# EAGLE design FrontendA (EAGLE 9.6.2)
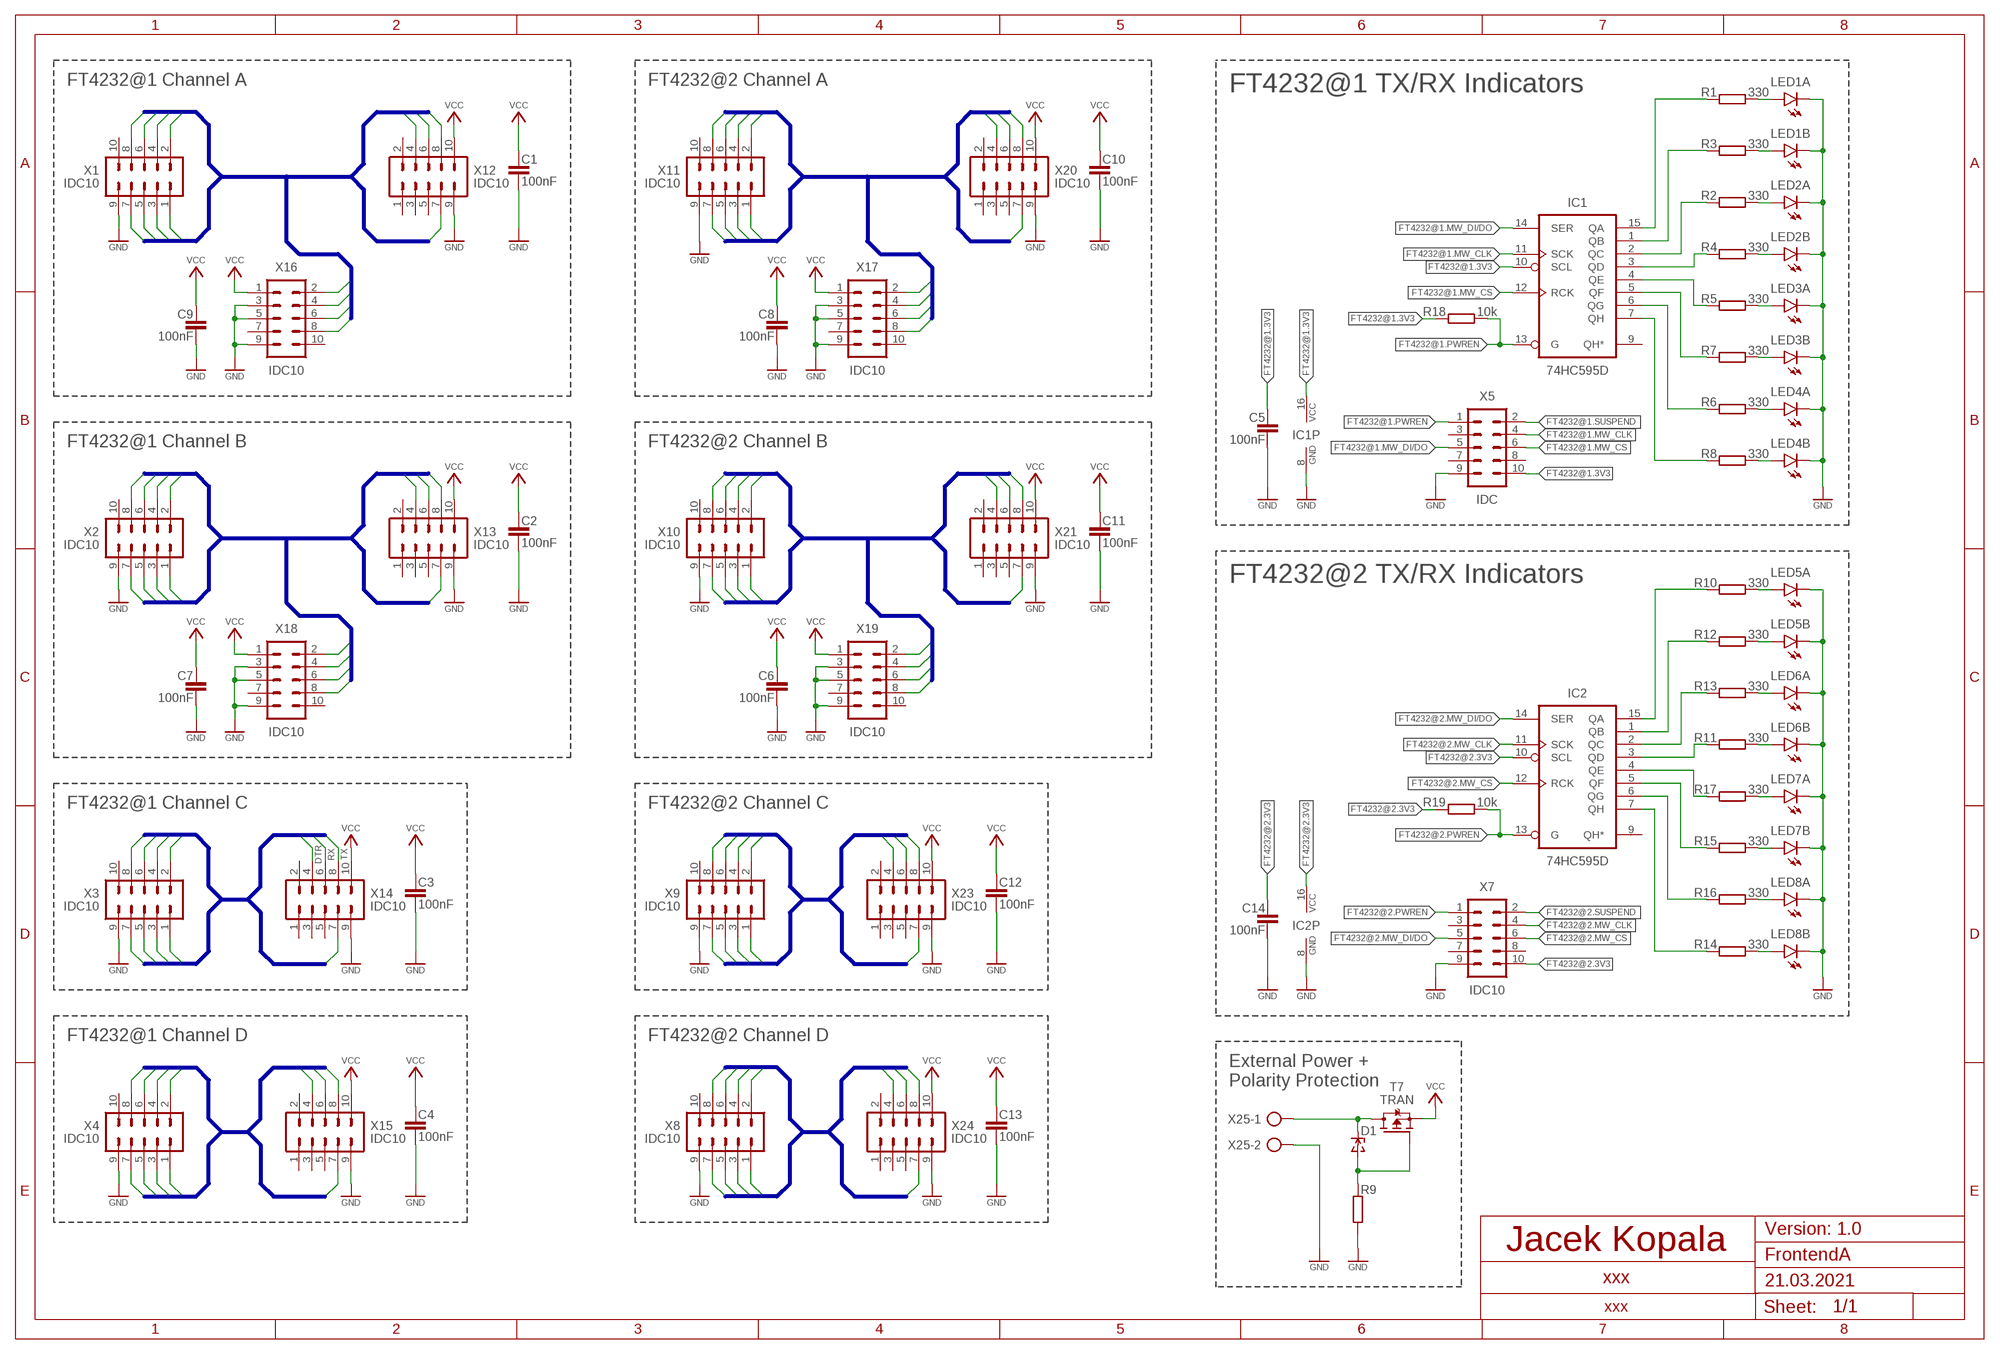
[diagram p0: schematic, sheet 1]

## Parts
C1  100nF  C-EUC0805  [C0805]
C2  100nF  C-EUC0805  [C0805]
C3  100nF  C-EUC0805  [C0805]
C4  100nF  C-EUC0805  [C0805]
C5  100nF  C-EUC0805  [C0805]
C6  100nF  C-EUC0805  [C0805]
C7  100nF  C-EUC0805  [C0805]
C8  100nF  C-EUC0805  [C0805]
C9  100nF  C-EUC0805  [C0805]
C10  100nF  C-EUC0805  [C0805]
C11  100nF  C-EUC0805  [C0805]
C12  100nF  C-EUC0805  [C0805]
C13  100nF  C-EUC0805  [C0805]
C14  100nF  C-EUC0805  [C0805]
D1  ZENERSOD-323F  [SOD-323F]
IC1  74HC595D  [SO16]
IC2  74HC595D  [SO16]
LED1  LSG-T676  [WL-SFCW-0603]
LED2  LSG-T676  [WL-SFCW-0603]
LED3  LSG-T676  [WL-SFCW-0603]
LED4  LSG-T676  [WL-SFCW-0603]
LED5  LSG-T676  [WL-SFCW-0603]
LED6  LSG-T676  [WL-SFCW-0603]
LED7  LSG-T676  [WL-SFCW-0603]
LED8  LSG-T676  [WL-SFCW-0603]
R1  330  R-EU_R0805  [R0805]
R2  330  R-EU_R0805  [R0805]
R3  330  R-EU_R0805  [R0805]
R4  330  R-EU_R0805  [R0805]
R5  330  R-EU_R0805  [R0805]
R6  330  R-EU_R0805  [R0805]
R7  330  R-EU_R0805  [R0805]
R8  330  R-EU_R0805  [R0805]
R9  R-EU_R0805  [R0805]
R10  330  R-EU_R0805  [R0805]
R11  330  R-EU_R0805  [R0805]
R12  330  R-EU_R0805  [R0805]
R13  330  R-EU_R0805  [R0805]
R14  330  R-EU_R0805  [R0805]
R15  330  R-EU_R0805  [R0805]
R16  330  R-EU_R0805  [R0805]
R17  330  R-EU_R0805  [R0805]
R18  10k  R-EU_R0805  [R0805]
R19  10k  R-EU_R0805  [R0805]
T7  TRAN  FDD4141TO252  [TO252]
X1  IDC10  MA05-2  [MA05-2]
X2  IDC10  MA05-2  [MA05-2]
X3  IDC10  MA05-2  [MA05-2]
X4  IDC10  MA05-2  [MA05-2]
X5  IDC  MA05-2  [MA05-2]
X7  IDC10  MA05-2  [MA05-2]
X8  IDC10  MA05-2  [MA05-2]
X9  IDC10  MA05-2  [MA05-2]
X10  IDC10  MA05-2  [MA05-2]
X11  IDC10  MA05-2  [MA05-2]
X12  IDC10  ML10  [ML10]
X13  IDC10  ML10  [ML10]
X14  IDC10  ML10  [ML10]
X15  IDC10  ML10  [ML10]
X16  IDC10  ML10  [ML10]
X17  IDC10  ML10  [ML10]
X18  IDC10  ML10  [ML10]
X19  IDC10  ML10  [ML10]
X20  IDC10  ML10  [ML10]
X21  IDC10  ML10  [ML10]
X23  IDC10  ML10  [ML10]
X24  IDC10  ML10  [ML10]
X25  AK500/2  [AK500/2]

## Nets
FT4232@1.3V3: C5.1 IC1.10(SCL) IC1.16(VCC) R18.2 X5.10
FT4232@1.AD0: X1.1 X12.8 X16.4
FT4232@1.AD1: X1.2 X12.6 X16.8
FT4232@1.AD2: X1.3 X12.7 X16.6
FT4232@1.AD3: X1.4 X16.2
FT4232@1.AD4: X1.5 X12.4
FT4232@1.AD5: X1.6
FT4232@1.AD6: X1.7
FT4232@1.AD7: X1.8
FT4232@1.BD0: X2.1 X13.8 X18.4
FT4232@1.BD1: X2.2 X13.6 X18.8
FT4232@1.BD2: X2.3 X13.7 X18.6
FT4232@1.BD3: X2.4 X18.2
FT4232@1.BD4: X2.5 X13.4
FT4232@1.BD5: X2.6
FT4232@1.BD6: X2.7
FT4232@1.BD7: X2.8
FT4232@1.CD0: X3.1 X14.8
FT4232@1.CD1: X3.2 X14.6
FT4232@1.CD2: X3.3 X14.7
FT4232@1.CD3: X3.4
FT4232@1.CD4: X3.5 X14.4
FT4232@1.CD5: X3.6
FT4232@1.CD6: X3.7
FT4232@1.CD7: X3.8
FT4232@1.DD0: X4.1 X15.8
FT4232@1.DD1: X4.2 X15.6
FT4232@1.DD2: X4.3 X15.7
FT4232@1.DD3: X4.4
FT4232@1.DD4: X4.5 X15.4
FT4232@1.DD5: X4.6
FT4232@1.DD6: X4.7
FT4232@1.DD7: X4.8
FT4232@1.MW_CLK: IC1.11(SCK) X5.4
FT4232@1.MW_CS: IC1.12(RCK) X5.6
FT4232@1.MW_DI/DO: IC1.14(SER) X5.5
FT4232@1.PWREN: IC1.13(G) R18.1 X5.1
FT4232@1.SUSPEND: X5.2
FT4232@2.3V3: C14.1 IC2.10(SCL) IC2.16(VCC) R19.2 X7.10
FT4232@2.AD0: X11.1 X17.4 X20.8
FT4232@2.AD1: X11.2 X17.8 X20.6
FT4232@2.AD2: X11.3 X17.6 X20.7
FT4232@2.AD3: X11.4 X17.2
FT4232@2.AD4: X11.5 X20.4
FT4232@2.AD5: X11.6
FT4232@2.AD6: X11.7
FT4232@2.AD7: X11.8
FT4232@2.BD0: X10.1 X19.4 X21.8
FT4232@2.BD1: X10.2 X19.8 X21.6
FT4232@2.BD2: X10.3 X19.6 X21.7
FT4232@2.BD3: X10.4 X19.2
FT4232@2.BD4: X10.5 X21.4
FT4232@2.BD5: X10.6
FT4232@2.BD6: X10.7
FT4232@2.BD7: X10.8
FT4232@2.CD0: X9.1 X23.8
FT4232@2.CD1: X9.2 X23.6
FT4232@2.CD2: X9.3 X23.7
FT4232@2.CD3: X9.4
FT4232@2.CD4: X9.5 X23.4
FT4232@2.CD5: X9.6
FT4232@2.CD6: X9.7
FT4232@2.CD7: X9.8
FT4232@2.DD0: X8.1 X24.8
FT4232@2.DD1: X8.2 X24.6
FT4232@2.DD2: X8.3 X24.7
FT4232@2.DD3: X8.4
FT4232@2.DD4: X8.5 X24.4
FT4232@2.DD5: X8.6
FT4232@2.DD6: X8.7
FT4232@2.DD7: X8.8
FT4232@2.MW_CLK: IC2.11(SCK) X7.4
FT4232@2.MW_CS: IC2.12(RCK) X7.6
FT4232@2.MW_DI/DO: IC2.14(SER) X7.5
FT4232@2.PWREN: IC2.13(G) R19.1 X7.1
FT4232@2.SUSPEND: X7.2
GND: C1.2 C2.2 C3.2 C4.2 C5.2 C6.2 C7.2 C8.2 C9.2 C10.2 C11.2 C12.2 C13.2 C14.2 IC1.8(GND) IC2.8(GND) LED1.P$1(A:C) LED1.P$3(B:C) LED2.P$1(A:C) LED2.P$3(B:C) LED3.P$1(A:C) LED3.P$3(B:C) LED4.P$1(A:C) LED4.P$3(B:C) LED5.P$1(A:C) LED5.P$3(B:C) LED6.P$1(A:C) LED6.P$3(B:C) LED7.P$1(A:C) LED7.P$3(B:C) LED8.P$1(A:C) LED8.P$3(B:C) R9.1 X1.9 X2.9 X3.9 X4.9 X5.9 X7.9 X8.9 X9.9 X10.9 X11.9 X12.9 X13.9 X14.9 X15.9 X16.3 X16.5 X16.9 X17.3 X17.5 X17.9 X18.3 X18.5 X18.9 X19.3 X19.5 X19.9 X20.9 X21.9 X23.9 X24.9 X25.2
N$5: LED1.P$2(A:A) R1.2
N$6: LED1.P$4(B:A) R3.2
N$7: LED5.P$2(A:A) R10.2
N$8: LED5.P$4(B:A) R12.2
N$9: LED2.P$2(A:A) R2.2
N$10: LED2.P$4(B:A) R4.2
N$11: LED3.P$2(A:A) R5.2
N$12: LED6.P$2(A:A) R13.2
N$13: LED3.P$4(B:A) R7.2
N$14: LED6.P$4(B:A) R11.2
N$15: LED4.P$2(A:A) R6.2
N$16: LED4.P$4(B:A) R8.2
N$17: IC1.3(QD) R4.1
N$18: IC1.4(QE) R5.1
N$19: IC1.2(QC) R2.1
N$20: IC1.1(QB) R3.1
N$21: IC1.15(QA) R1.1
N$22: IC1.5(QF) R7.1
N$23: IC1.6(QG) R6.1
N$24: IC1.7(QH) R8.1
N$25: LED7.P$2(A:A) R17.2
N$26: LED7.P$4(B:A) R15.2
N$27: LED8.P$2(A:A) R16.2
N$28: LED8.P$4(B:A) R14.2
N$29: IC2.3(QD) R11.1
N$30: IC2.4(QE) R17.1
N$31: IC2.2(QC) R13.1
N$32: IC2.1(QB) R12.1
N$33: IC2.15(QA) R10.1
N$34: IC2.5(QF) R15.1
N$35: IC2.6(QG) R16.1
N$36: IC2.7(QH) R14.1
N$37: D1.A R9.2 T7.1(G)
VCC: C1.1 C2.1 C3.1 C4.1 C6.1 C7.1 C8.1 C9.1 C10.1 C11.1 C12.1 C13.1 T7.2(S) X12.10 X13.10 X14.10 X15.10 X16.1 X17.1 X18.1 X19.1 X20.10 X21.10 X23.10 X24.10
VIN: D1.C T7.3(D) X25.1
Unconnected: IC1.9(QH*) IC2.9(QH*) X1.10 X2.10 X3.10 X4.10 X5.3 X5.7 X5.8 X7.3 X7.7 X7.8 X8.10 X9.10 X10.10 X11.10 X12.1 X12.2 X12.3 X12.5 X13.1 X13.2 X13.3 X13.5 X14.1 X14.2 X14.3 X14.5 X15.1 X15.2 X15.3 X15.5 X16.7 X16.10 X17.7 X17.10 X18.7 X18.10 X19.7 X19.10 X20.1 X20.2 X20.3 X20.5 X21.1 X21.2 X21.3 X21.5 X23.1 X23.2 X23.3 X23.5 X24.1 X24.2 X24.3 X24.5

## Buses
FT4232@1.CD0,FT4232@1.CD1,FT4232@1.CD2,FT4232@1.CD3,FT4232@1.CD4,FT4232@1.CD5,FT4232@1.CD6,FT4232@1.CD7
FT4232@1.DD[0..7]
FT4232@2.DD[0..7]
FT4232@2.CD[0..7]
FT4232@1.AD[0..7]
FT4232@1.BD[0..7]
FT4232@2.AD[0..7]
FT4232@2.BD[0..7]

## Notes on the sheet
- FT4232@1 Channel A | FT4232@2 Channel A | FT4232@1 TX/RX Indicators
- FT4232@1 Channel B | FT4232@2 Channel B
- FT4232@2 TX/RX Indicators
- FT4232@1 Channel C | FT4232@2 Channel C
- DTR | RX | TX
- FT4232@1 Channel D | FT4232@2 Channel D
- External Power +
  Polarity Protection
- Jacek Kopala | Version: 1.0
- xxx
- 21.03.2021
- xxx

## Library data of the parts
C1-C14 = rcl:C-EU: CAPACITOR, European symbol; SPICEPREFIX: C
D1 = dp_devices.v6:ZENER: Zener Diode SOD-323
IC1 IC2 = 74xx-eu:74*595: 8-bit SHIFT REGISTER, output latch
LED1-LED8 = custom_jatsekku:LSG-T676: LSG T676 Hyper Multi TOPLED ® Hyper-Bright LED Source: http://docs-europe.electrocomponents.com/webdocs/08c3/0900766b808c36ca.pdf
R1-R19 = rcl:R-EU_: RESISTOR, European symbol; SPICEPREFIX: R
T7 = transistor-fet:FDD4141: P-Channel PowerTrench® MOSFET Source: FDD4141.pdf
X1-X5 X7-X11 = con-lstb-mirrored:MA05-2: PIN HEADER; OC_FARNELL: unknown; OC_NEWARK: unknown
X12-X21 X23 X24 = con-harting-ml:ML10: HARTING; OC_FARNELL: unknown; OC_NEWARK: unknown
X25 = con-ptr500:AK500/2: CONNECTOR; OC_FARNELL: unknown; OC_NEWARK: unknown

## Board
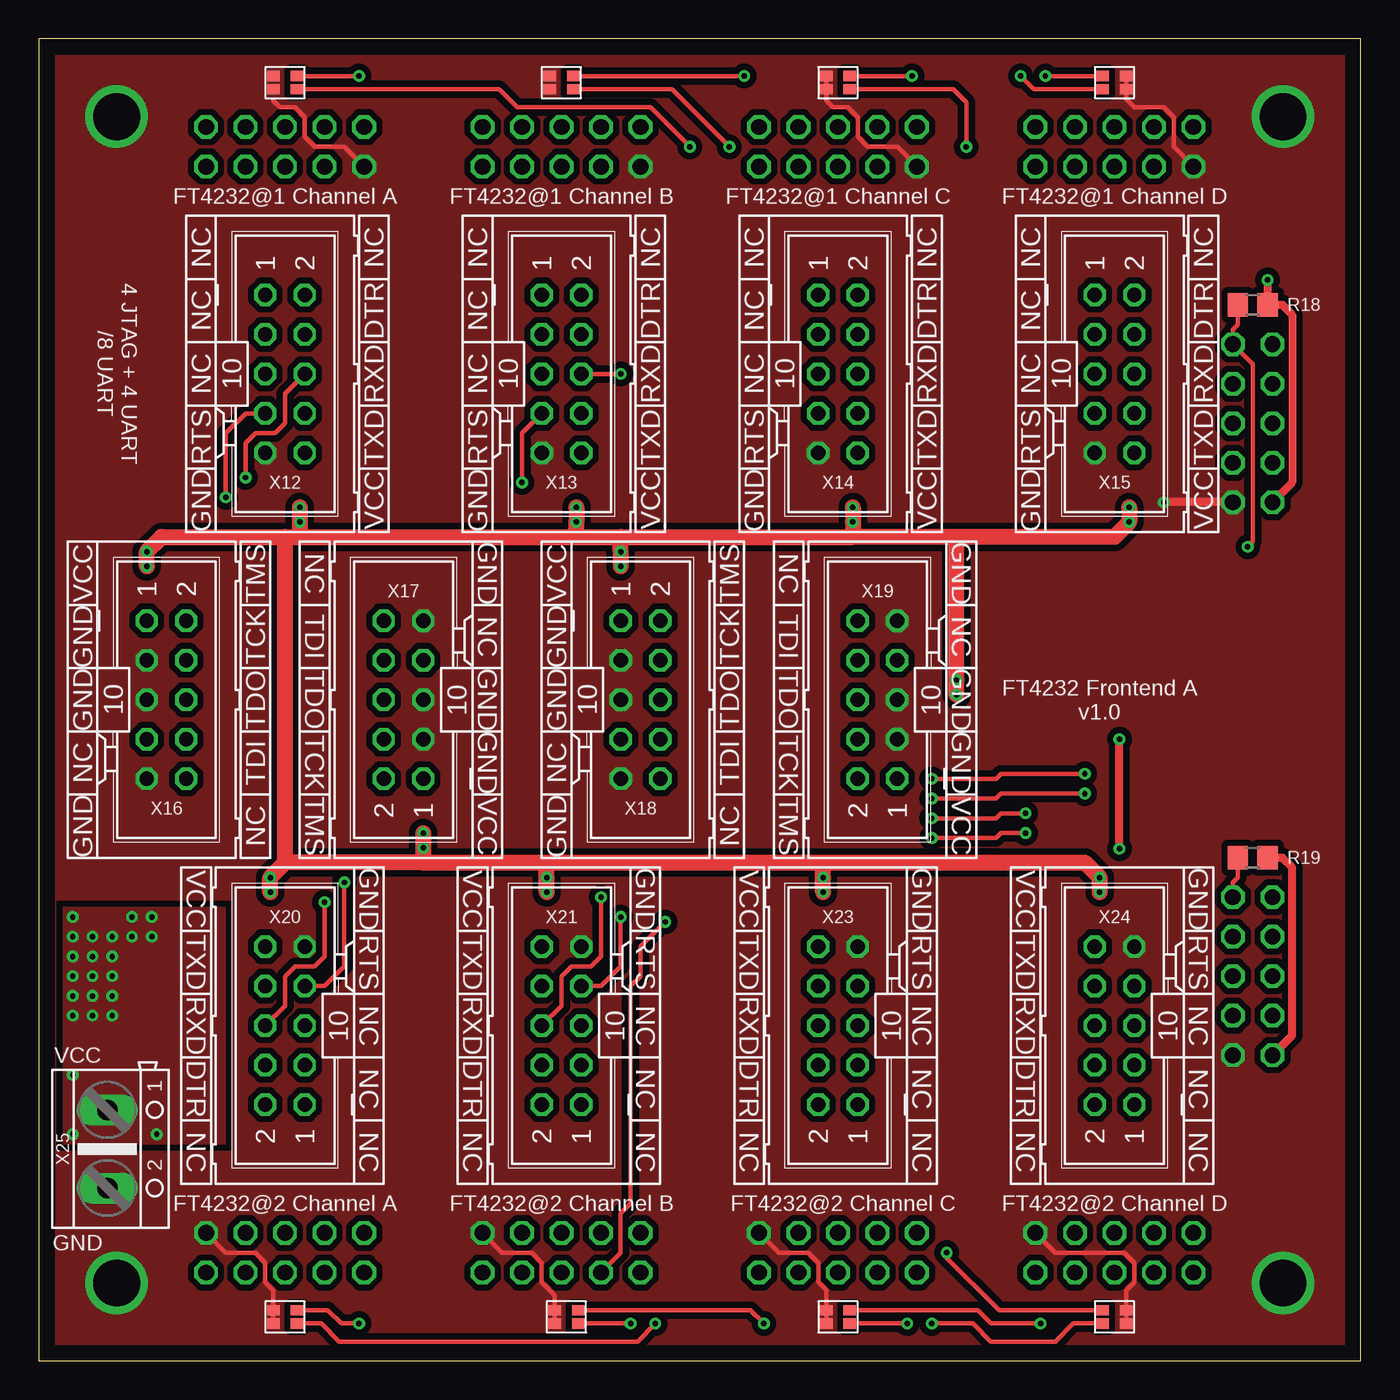
[diagram p1: board, top side]
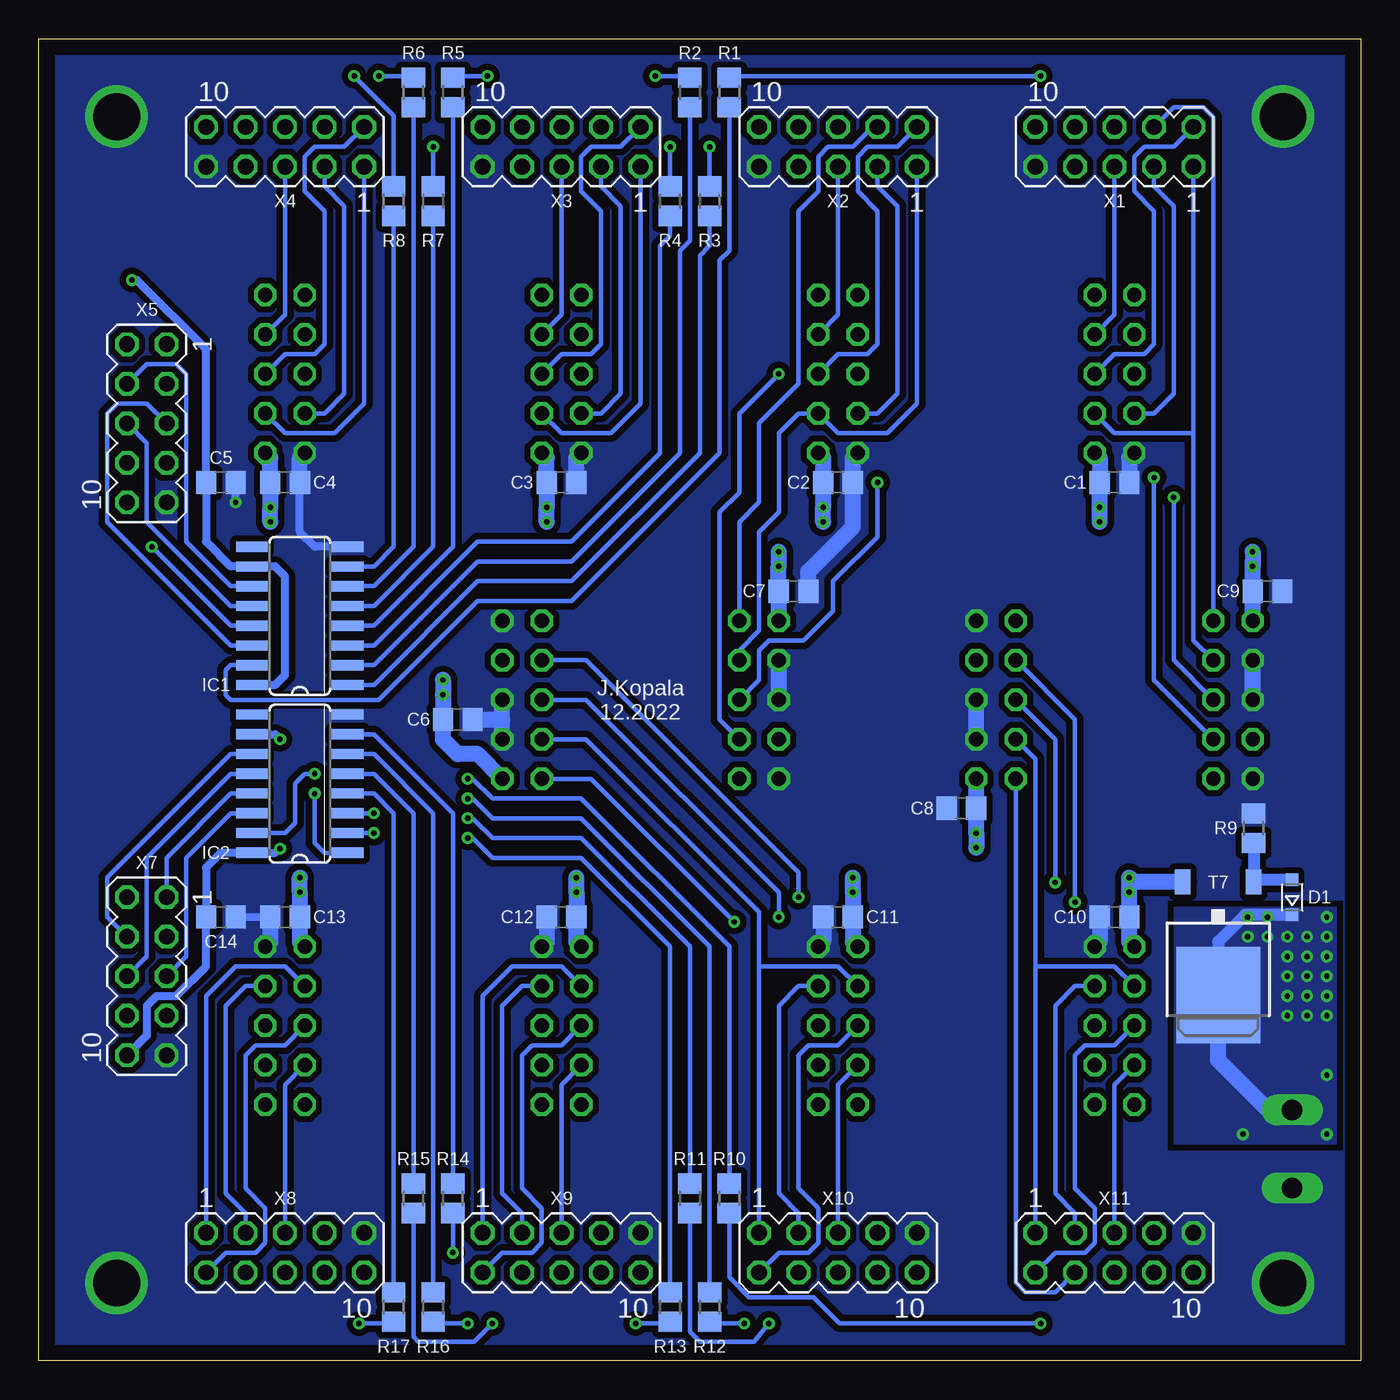
[diagram p2: board, bottom side, seen from below]

Size 85 x 85 mm. Coordinates in mm from the lower left corner, seen from the top.
Outline: 0,0 85,0 85,85 0,85 0,0
Copper layers (1*16): Top 0.035mm / dielectric 1.5mm / Bottom 0.035mm
Design rules "default": minimum track width 6mil, minimum drill 0.35mm, track to track 6mil, track to pad 6mil, pad to pad 6mil, via to via 6mil, smd to smd 6mil, copper to edge 40mil, drill to drill 6mil, minimum pad ring 10mil, minimum via ring 8mil, stop-mask expansion 4mil, vias tented up to drill 0mil, thermal gap 10mil

### Footprints (pad centres in the part's own frame; a part is rotated, then mirrored left to right if it is on the bottom)
C0805 = smd 1.3 x 1.5: 1 -0.95,0; 2 0.95,0
SOD-323F = smd 0.8 x 0.8: A 1.125,0; C -1.125,0
SO16 = smd 0.66 x 2.032: 1 -4.445,-3.073; 2 -3.175,-3.073; 3 -1.905,-3.073; 4 -0.635,-3.073; 5 0.635,-3.073; 6 1.905,-3.073; 7 3.175,-3.073; 8 4.445,-3.073; 9 4.445,3.073; 10 3.175,3.073; 11 1.905,3.073; 12 0.635,3.073; 13 -0.635,3.073; 14 -1.905,3.073; 15 -3.175,3.073; 16 -4.445,3.073
WL-SFCW-0603 = smd 0.8 x 0.65: P$1 -0.75,0.425; P$2 0.75,0.425; P$3 -0.75,-0.425; P$4 0.75,-0.425
R0805 = smd 1.3 x 1.5: 1 -0.95,0; 2 0.95,0
TO252 = smd 1 x 1.6: 1 -2.28,-4.8; 2 2.28,-4.8 | smd 5.4 x 6.2: 3 0,2.5
MA05-2 = drill 1.016 octagon: 1 -5.08,-1.27; 2 -5.08,1.27; 3 -2.54,-1.27; 4 -2.54,1.27; 5 0,-1.27; 6 0,1.27; 7 2.54,-1.27; 8 2.54,1.27; 9 5.08,-1.27; 10 5.08,1.27
ML10 = drill 0.914 octagon: 1 -5.08,-1.27; 2 -5.08,1.27; 3 -2.54,-1.27; 4 -2.54,1.27; 5 0,-1.27; 6 0,1.27; 7 2.54,-1.27; 8 2.54,1.27; 9 5.08,-1.27; 10 5.08,1.27
AK500/2 = drill 1.321 long: 1 -2.515,0; 2 2.515,0

### Placement (x,y rotation side)
C1  15.83,56.47 0 bottom
C2  33.61,56.47 0 bottom
C3  51.39,56.47 0 bottom
C4  69.17,56.47 0 bottom
C5  73.3,56.47 0 bottom
C6  58.06,41.23 0 bottom
C7  36.47,49.48 0 bottom
C8  25.67,35.52 180 bottom
C9  5.99,49.48 0 bottom
C10  15.83,28.53 180 bottom
C11  33.61,28.53 180 bottom
C12  51.39,28.53 180 bottom
C13  69.17,28.53 180 bottom
C14  73.3,28.53 0 bottom
D1  4.4,29.8 90 bottom
IC1  68.22,47.9 90 bottom
IC2  68.22,37.1 90 bottom
LED1  15.83,82.19 0 top
LED2  33.61,82.19 0 top
LED3  51.39,82.19 0 top
LED4  69.17,82.19 180 top
LED5  15.83,2.81 0 top
LED6  33.93,2.81 0 top
LED7  51.39,2.81 0 top
LED8  69.17,2.81 180 top
R1  40.59,81.55 90 bottom
R2  43.13,81.55 90 bottom
R3  41.87,74.57 90 bottom
R4  44.41,74.57 90 bottom
R5  58.38,81.55 90 bottom
R6  60.91,81.55 90 bottom
R7  59.64,74.57 90 bottom
R8  62.19,74.57 90 bottom
R9  6.88,34.24 270 bottom
R10  40.59,10.43 270 bottom
R11  43.13,10.43 270 bottom
R12  41.87,3.45 270 bottom
R13  44.41,3.45 270 bottom
R14  58.38,10.43 270 bottom
R15  60.91,10.43 270 bottom
R16  59.64,3.45 270 bottom
R17  62.19,3.45 270 bottom
R18  78.06,67.9 0 top
R19  78.06,32.34 0 top
T7  9.16,25.99 180 bottom
X1  15.83,78.06 0 top
X2  33.61,78.06 0 top
X3  51.39,78.06 0 top
X4  69.17,78.06 0 top
X5  78.06,60.28 270 top
X7  78.06,24.72 270 top
X8  69.17,6.94 180 top
X9  51.39,6.94 180 top
X10  33.61,6.94 180 top
X11  15.83,6.94 180 top
X12  15.83,63.45 270 top
X13  33.61,63.45 270 top
X14  51.39,63.45 270 top
X15  69.17,63.45 270 top
X16  8.21,42.5 270 top
X17  23.45,42.5 90 top
X18  38.69,42.5 270 top
X19  53.93,42.5 90 top
X20  15.83,21.55 90 top
X21  33.61,21.55 90 top
X23  51.39,21.55 90 top
X24  69.17,21.55 90 top
X25  4.4,13.61 270 top

### Tracks (layer width: path | path; a pad name or v marks a point on that pad's centre or on a via)
FT4232@1.3V3  (via drill 0.35)
  Top 0.508: X5.10 80.6,56.47 80.6,67.26 79.96,67.9 R18.2 v79.01,69.49
  Bottom 0.508: IC1.16 69.81,43.45 69.17,44.09 69.17,50.44 69.81,51.07 IC1.10 72.66,51.07 74.25,52.66 C5.1 74.25,65.04 78.69,69.49 v79.01,69.49
FT4232@1.AD0
  Bottom 0.305: X12.8 15.83,59.64 10.75,59.64 | X1.1 10.75,59.64 | X16.4 10.75,46.31 10.75,59.64
FT4232@1.AD1  (via drill 0.35)
  Top 0.305: v13.29,56.79 13.29,59.01 13.93,59.64 15.2,59.64 15.83,60.28 15.83,62.19 X12.6
  Bottom 0.305: X12.6 15.83,64.72 13.93,64.72 13.29,65.36 13.29,73.93 14.56,75.2 14.56,77.42 13.93,78.06 12.02,78.06 X1.2 | X16.8 13.29,43.77 v13.29,56.79
FT4232@1.AD2  (via drill 0.35)
  Top 0.305: X12.7 13.29,60.91 12.02,59.64 v12.02,55.52
  Bottom 0.305: X12.7 13.29,60.91 12.02,62.19 12.02,74.25 13.29,75.52 X1.3 | v12.02,55.52 12.02,45.04 X16.6
FT4232@1.AD3
  Bottom 0.305: X16.2 9.48,79.97 10.12,80.6 12.02,80.6 X1.4
FT4232@1.AD4
  Bottom 0.305: X12.4 15.83,67.27 X1.5
FT4232@1.BD0
  Bottom 0.305: X2.1 28.53,61.55 30.44,59.64 33.61,59.64 X13.8 36.15,60.91 37.42,59.64 37.42,54.56 38.69,53.3 38.69,46.95 39.96,45.67 X18.4
FT4232@1.BD1  (via drill 0.35)
  Top 0.305: v37.42,63.45 X13.6
  Bottom 0.305: X13.6 33.61,64.72 31.7,64.72 31.07,65.36 31.07,73.93 32.34,75.2 32.34,77.42 31.7,78.06 29.8,78.06 X2.2 | X18.8 41.23,41.23 41.23,54.56 39.96,55.84 39.96,60.91 v37.42,63.45
FT4232@1.BD2  (via drill 0.35)
  Top 0.305: v31.07,56.47 31.07,59.64 X13.7
  Bottom 0.305: X13.7 31.07,60.91 29.8,62.19 29.8,74.25 31.07,75.52 X2.3 | X18.6 38.69,43.77 38.69,45.67 38.05,46.31 35.83,46.31 33.93,48.22 33.93,50.12 31.07,52.98 v31.07,56.47
FT4232@1.BD3
  Bottom 0.305: X2.4 31.39,79.33 32.66,78.06 34.24,78.06 34.88,77.42 34.88,75.2 36.15,73.93 36.15,62.82 38.69,60.28 38.69,55.2 39.96,53.93 X18.2
FT4232@1.BD4
  Bottom 0.305: X13.4 33.61,67.27 X2.5
FT4232@1.CD0
  Bottom 0.305: X14.8 51.39,59.64 48.22,59.64 46.31,61.55 X3.1
FT4232@1.CD1
  Bottom 0.305: X14.6 51.39,64.72 49.48,64.72 48.85,65.36 48.85,73.93 50.12,75.2 50.12,77.42 49.48,78.06 47.58,78.06 X3.2
FT4232@1.CD2
  Bottom 0.305: X14.7 48.85,60.91 47.58,62.19 47.58,74.25 48.85,75.52 X3.3
FT4232@1.CD4
  Bottom 0.305: X14.4 51.39,67.27 X3.5
FT4232@1.DD0
  Bottom 0.305: X15.8 69.17,59.64 66,59.64 64.09,61.55 X4.1
FT4232@1.DD1
  Bottom 0.305: X15.6 69.17,64.72 67.27,64.72 66.63,65.36 66.63,73.93 67.9,75.2 67.9,77.42 67.27,78.06 65.36,78.06 X4.2
FT4232@1.DD2
  Bottom 0.305: X15.7 66.63,60.91 65.36,62.19 65.36,74.25 66.63,75.52 X4.3
FT4232@1.DD4
  Bottom 0.305: X15.4 69.17,67.27 X4.5
FT4232@1.MW_CLK
  Bottom 0.305: IC1.11 72.66,49.8 75.52,52.66 75.52,63.44 76.16,64.08 78.07,64.08 X5.4
FT4232@1.MW_CS
  Bottom 0.305: IC1.12 72.66,48.53 78.06,53.93 78.06,59.01 X5.6
FT4232@1.MW_DI/DO
  Bottom 0.305: IC1.14 72.66,45.99 80.6,53.93 80.6,60.91 79.97,61.55 78.06,61.55 X5.5
FT4232@1.PWREN  (via drill 0.35)
  Top 0.305: v77.74,52.34 78.06,52.66 78.06,64.09 X5.1 76.79,66.31 77.11,66.63 R18.1
  Bottom 0.305: IC1.13 72.66,47.26 v77.74,52.34
FT4232@2.3V3  (via drill 0.35)
  Top 0.508: X7.10 80.6,20.91 80.6,31.7 79.96,32.34 R19.2 | v69.49,32.93 v69.49,39.96
  Bottom 0.305: C14.1 74.25,28.21 | 69.53,32.93 v69.49,32.93
  Bottom 0.508: X7.10 78.06,20.91 78.06,22.82 77.42,23.45 76.16,23.45 74.25,25.36 74.25,28.21 | 74.25,28.21 74.25,31.7 73.3,32.66 IC2.16 69.81,32.66 69.53,32.93 | IC2.10 69.81,40.28 v69.49,39.96
FT4232@2.AD0
  Bottom 0.305: X20.8 15.83,25.36 20.91,25.36 | X11.1 20.91,25.36 | X17.4 20.91,38.69 20.91,25.36
FT4232@2.AD1  (via drill 0.35)
  Top 0.305: X20.6 15.83,22.82 15.83,24.72 16.46,25.36 17.73,25.36 18.37,25.99 v18.37,29.48
  Bottom 0.305: X20.6 15.83,20.27 17.73,20.27 18.37,19.64 18.37,11.07 17.1,9.8 17.1,7.58 17.73,6.94 19.64,6.94 X11.2 | X17.8 18.37,41.23 v18.37,29.48
FT4232@2.AD2  (via drill 0.35)
  Top 0.305: X20.7 18.37,24.09 19.64,25.36 v19.64,30.75
  Bottom 0.305: X20.7 18.37,24.09 19.64,22.82 19.64,10.75 18.37,9.48 X11.3 | v19.64,30.75 19.64,39.96 X17.6
FT4232@2.AD3
  Bottom 0.305: X17.2 22.18,5.03 21.55,4.4 19.64,4.4 X11.4
FT4232@2.AD4
  Bottom 0.305: X20.4 15.83,17.73 X11.5
FT4232@2.BD0
  Bottom 0.305: X21.8 33.61,25.36 38.69,25.36 | 38.69,25.36 X10.1 | 38.69,25.36 38.69,28.85 49.8,39.96 X19.4
FT4232@2.BD1  (via drill 0.35)
  Top 0.305: X21.6 33.61,22.82 33.61,24.72 34.24,25.36 35.52,25.36 36.15,25.99 v36.15,29.8
  Bottom 0.305: X21.6 33.61,20.27 35.52,20.27 36.15,19.64 36.15,11.07 34.88,9.8 34.88,7.58 35.52,6.94 37.42,6.94 X10.2 | X19.8 49.8,45.04 36.15,31.39 v36.15,29.8
FT4232@2.BD2  (via drill 0.35)
  Top 0.305: X21.7 36.15,24.09 37.42,25.36 v37.42,28.53
  Bottom 0.305: X21.7 36.15,24.09 37.42,22.82 37.42,10.75 36.15,9.48 X10.3 | v37.42,28.53 37.42,30.12 49.8,42.5 X19.6
FT4232@2.BD3  (via drill 0.35)
  Top 0.305: X10.4 37.42,6.94 37.42,9.48 38.05,10.12 38.05,24.09 38.69,24.72 38.69,26.62 v40.28,28.21
  Bottom 0.305: v40.28,28.21 49.48,37.42 X19.2
FT4232@2.BD4
  Bottom 0.305: X21.4 33.61,17.73 X10.5
FT4232@2.CD0
  Bottom 0.305: X23.8 51.39,25.36 54.56,25.36 56.47,23.45 X9.1
FT4232@2.CD1
  Bottom 0.305: X23.6 51.39,20.27 53.3,20.27 53.93,19.64 53.93,11.07 52.66,9.8 52.66,7.58 53.3,6.94 55.2,6.94 X9.2
FT4232@2.CD2
  Bottom 0.305: X23.7 53.93,24.09 55.2,22.82 55.2,10.75 53.93,9.48 X9.3
FT4232@2.CD4
  Bottom 0.305: X23.4 51.39,17.73 X9.5
FT4232@2.DD0
  Bottom 0.305: X24.8 69.17,25.36 72.34,25.36 74.09,23.61 74.25,23.45 X8.1
FT4232@2.DD1
  Bottom 0.305: X24.6 69.17,20.27 71.08,20.27 71.71,19.64 71.71,11.07 70.44,9.8 70.44,7.58 71.08,6.94 72.98,6.94 X8.2
FT4232@2.DD2
  Bottom 0.305: X24.7 71.71,24.09 72.98,22.82 72.98,10.75 71.71,9.48 X8.3
FT4232@2.DD4
  Bottom 0.305: X24.4 69.17,17.73 X8.5
FT4232@2.MW_CLK
  Bottom 0.305: X7.4 80.6,28.53 80.6,31.07 72.66,39.01 IC2.11
FT4232@2.MW_CS
  Bottom 0.305: IC2.12 72.66,37.74 78.06,32.34 78.06,25.99 X7.6
FT4232@2.MW_DI/DO
  Bottom 0.305: IC2.14 72.66,35.2 75.52,32.34 75.52,25.99 X7.5
FT4232@2.PWREN
  Top 0.305: R19.1 77.11,31.07 76.79,30.75 X7.1
  Bottom 0.305: IC2.13 72.66,36.47 76.79,32.34 X7.1
GND  (via drill 0.35, 3)
  Top 0.305: LED3.P$1 LED3.P$3 50.64,81.03 51.07,80.6 52.02,80.6 52.66,79.97 52.66,78.69 53.3,78.06 55.2,78.06 X3.9 | LED8.P$1 LED8.P$3 69.92,4.52 70.44,5.03 70.44,6.3 69.81,6.94 65.36,6.94 X8.9 | LED7.P$3 LED7.P$1 50.64,4.52 50.12,5.03 50.12,6.3 49.48,6.94 47.58,6.94 X9.9 | LED6.P$3 LED6.P$1 33.18,4.2 32.34,5.03 32.34,6.3 31.7,6.94 29.8,6.94 X10.9 | LED5.P$3 LED5.P$1 15.08,4.52 14.56,5.03 14.56,6.3 13.93,6.94 12.02,6.94 X11.9 | X1.9 19.64,78.06 17.73,78.06 17.1,78.69 17.1,79.97 16.46,80.6 15.51,80.6 15.08,81.03 | X4.9 72.98,78.06 72.98,79.97 72.34,80.6 70.44,80.6 69.92,81.12 LED4.P$1 LED4.P$3
  Top 0.508: X5.9 v72.34,55.2
  Bottom 0.508: IC1.8 67.27,52.34 68.22,53.3 C4.2 | C14.2 C13.2 | v72.34,55.2 C5.2
  Bottom 1.016: C10.2 16.78,26.95 X20.9 | X12.9 14.88,58.05 C1.2 | C11.2 34.56,26.95 X21.9 | X13.9 32.66,58.05 C2.2 32.66,53.61 35.52,50.75 C7.2 | X14.9 50.44,58.05 C3.2 | C4.2 68.22,58.05 X15.9 | C12.2 52.34,26.95 X23.9 | C13.2 70.12,26.95 X24.9 | X17.3 X17.5 | X18.5 X18.3 | X16.5 X16.3 | X19.3 55.2,41.23 | 55.2,41.23 X19.5 | C6.2 55.2,41.23
  other vias: 5,80 5,5 80,5 80,80
  pour Top (isolate 0.406, rank 2, no thermals): 1,84 84,84 84,1 1,1
  pour Bottom (isolate 0.406, rank 2, no thermals): 1,84 84,84 84,1 1.5,1 1,1
N$5  (via drill 0.35)
  Top 0.305: LED1.P$2 v20.59,82.61
  Bottom 0.305: v20.59,82.61 40.48,82.61 R1.2
N$6  (via drill 0.35)
  Top 0.305: LED1.P$4 29.59,81.76 30.75,80.6 39.33,80.6 v41.87,78.06
  Bottom 0.305: v41.87,78.06 R3.2
N$7  (via drill 0.35)
  Top 0.305: LED5.P$2 18.58,3.24 19.43,2.39 v20.59,2.39
  Bottom 0.305: R10.2 40.59,5.35 39.33,4.08 35.2,4.08 33.5,2.39 v20.59,2.39
N$8  (via drill 0.35)
  Top 0.305: v39.65,2.39 38.48,1.23 19.32,1.23 18.16,2.39 LED5.P$4
  Bottom 0.305: v39.65,2.39 41.76,2.39 R12.2
N$9  (via drill 0.35)
  Top 0.305: LED2.P$2 v45.36,82.61
  Bottom 0.305: v45.36,82.61 43.24,82.61 R2.2
N$10  (via drill 0.35)
  Top 0.305: LED2.P$4 40.7,81.76 v44.41,78.06
  Bottom 0.305: v44.41,78.06 R4.2
N$11  (via drill 0.35)
  Top 0.305: LED3.P$2 v56.15,82.61
  Bottom 0.305: v56.15,82.61 58.27,82.61 R5.2
N$12  (via drill 0.35)
  Top 0.305: LED6.P$2 45.78,3.24 v46.63,2.39
  Bottom 0.305: v46.63,2.39 44.52,2.39 R13.2
N$13  (via drill 0.35)
  Top 0.305: v59.64,78.06 59.64,80.92 58.8,81.76 LED3.P$4
  Bottom 0.305: R7.2 v59.64,78.06
N$14  (via drill 0.35)
  Top 0.305: v38.05,2.39 LED6.P$4
  Bottom 0.305: R11.2 43.13,1.86 42.5,1.23 39.01,1.23 v38.05,2.39
N$15  (via drill 0.35)
  Top 0.305: LED4.P$2 63.99,81.76 v63.14,82.61
  Bottom 0.305: R6.2 61.02,82.61 v63.14,82.61
N$16  (via drill 0.35)
  Top 0.305: LED4.P$4 v64.72,82.61
  Bottom 0.305: v64.72,82.61 62.19,80.07 R8.2
N$17
  Bottom 0.305: IC1.3 63.45,45.99 56.79,52.66 50.76,52.66 45.04,58.38 45.04,71.71 44.41,72.34 R4.1
N$18
  Bottom 0.305: IC1.4 63.45,47.26 58.38,52.34 R5.1
N$19
  Bottom 0.305: IC1.2 63.45,44.72 56.79,51.39 50.76,51.39 43.77,58.38 43.77,71.39 43.13,72.03 R2.1
N$20
  Bottom 0.305: IC1.1 63.45,43.45 56.79,50.12 50.76,50.12 42.5,58.38 42.5,71.08 41.87,71.71 R3.1
N$21
  Bottom 0.305: R1.1 40.59,71.39 41.23,70.76 41.23,58.38 50.76,48.85 56.79,48.85 63.14,42.5 72.66,42.5 72.98,42.82 72.98,44.41 72.66,44.72 IC1.15
N$22
  Bottom 0.305: R7.1 59.64,52.34 63.45,48.53 IC1.5
N$23
  Bottom 0.305: IC1.6 63.45,49.8 60.91,52.34 R6.1
N$24
  Bottom 0.305: IC1.7 63.45,51.07 62.19,52.34 R8.1
N$25  (via drill 0.35)
  Top 0.305: LED7.P$2 60.38,3.24 61.23,2.39 v64.41,2.39
  Bottom 0.305: R17.2 62.3,2.39 v64.41,2.39
N$26  (via drill 0.35)
  Top 0.305: LED7.P$4 v55.84,2.39
  Bottom 0.305: v55.84,2.39 57,1.23 60.6,1.23 60.91,1.54 R15.2
N$27  (via drill 0.35)
  Top 0.305: LED8.P$2 66.52,2.39 65.36,1.23 61.23,1.23 60.07,2.39 v57.42,2.39
  Bottom 0.305: v57.42,2.39 59.53,2.39 R16.2
N$28  (via drill 0.35)
  Top 0.305: LED8.P$4 61.76,3.24 58.38,6.62 v58.38,6.94
  Bottom 0.305: R14.2 v58.38,6.94
N$29  (via drill 0.35)
  Top 0.305: v63.45,35.2 61.87,35.2 61.55,34.88 v57.42,34.88
  Bottom 0.305: IC2.3 v63.45,35.2 | v57.42,34.88 57.11,34.88 55.84,33.61 50.12,33.61 43.13,26.62 R11.1
N$30
  Bottom 0.305: R17.1 62.19,35.2 63.45,36.47 IC2.4
N$31  (via drill 0.35)
  Top 0.305: v63.45,33.93 61.87,33.93 61.55,33.61 v57.42,33.61
  Bottom 0.305: IC2.2 v63.45,33.93 | v57.42,33.61 57.11,33.61 55.84,32.34 50.12,32.34 44.41,26.62 R13.1
N$32  (via drill 0.35)
  Top 0.305: v67.27,36.47 61.87,36.47 61.55,36.15 v57.42,36.15
  Bottom 0.305: IC2.1 66.63,32.66 67.27,33.29 v67.27,36.47 | v57.42,36.15 57.11,36.15 55.84,34.88 50.12,34.88 41.87,26.62 R12.1
N$33  (via drill 0.35)
  Top 0.305: v67.27,37.74 61.87,37.74 61.55,37.42 v57.42,37.42
  Bottom 0.305: IC2.15 69.17,33.93 68.53,34.56 68.53,37.1 67.9,37.74 v67.27,37.74 | v57.42,37.42 57.11,37.42 55.84,36.15 50.12,36.15 40.59,26.62 R10.1
N$34
  Bottom 0.305: R15.1 60.91,35.2 63.45,37.74 IC2.5
N$35
  Bottom 0.305: IC2.6 63.45,39.01 59.64,35.2 R16.1
N$36
  Bottom 0.305: R14.1 58.38,35.2 63.45,40.28 IC2.7
N$37
  Bottom 0.508: 6.75,30.93 T7.1
  Bottom 0.762: D1.A 6.75,30.93 | R9.2 T7.1
VCC  (via drill 0.35)
  Top 1.016: 16.78,52.98 34.56,52.98 | 34.56,52.98 37.42,52.98 | 37.42,52.98 52.34,52.98 | v16.78,54.88 v16.78,53.93 16.78,52.98 | v34.56,54.88 v34.56,53.93 34.56,52.98 | 52.34,52.98 v52.34,53.93 v52.34,54.88 | v6.94,51.07 v6.94,52.02 7.89,52.98 15.83,52.98 | 15.83,52.98 16.78,52.98 | v70.12,54.88 v70.12,53.93 69.17,52.98 59.01,52.98 | 59.01,52.98 52.34,52.98 | v14.88,30.12 v14.88,31.07 15.83,32.02 | 24.72,32.02 15.83,32.02 | 24.72,32.02 32.66,32.02 | 32.66,32.02 50.44,32.02 | 50.44,32.02 67.27,32.02 v68.22,31.07 v68.22,30.12 | v50.44,30.12 v50.44,31.07 50.44,32.02 | v32.66,30.12 v32.66,31.07 32.66,32.02 | 37.42,52.98 v37.42,52.02 v37.42,51.07 | v24.72,33.93 v24.72,32.98 24.72,32.02 | 59.01,52.98 v59.01,43.77 v59.01,42.82 | 15.83,32.02 15.83,52.98
  Bottom 0.508: 14.84,28.57 C10.1
  Bottom 1.016: X20.10 14.88,26.95 C10.1 v14.88,30.12 v14.88,31.07 14.6,30.79 T7.2 | X12.10 16.78,58.05 C1.1 v16.78,53.93 | X21.10 32.66,26.95 C11.1 v32.66,30.12 v32.66,31.07 | X13.10 34.56,58.05 C2.1 v34.56,54.88 v34.56,53.93 | X16.1 C9.1 v6.94,51.07 | X18.1 C7.1 v37.42,51.07 v37.42,52.02 | X19.1 56.79,39.01 58.06,39.01 59.01,39.96 C6.1 | X14.10 52.34,58.05 C3.1 v52.34,54.88 v52.34,53.93 | X15.10 70.12,58.05 C4.1 v70.12,54.88 v70.12,53.93 | X23.10 50.44,26.95 C12.1 v50.44,30.12 v50.44,31.07 | X24.10 68.22,26.95 C13.1 v68.22,30.12 v68.22,31.07 | v6.94,51.07 6.94,51.39 | v6.94,52.02 v6.94,51.07 | v24.72,32.98 v24.72,33.93 C8.1 X17.1 | C6.1 v59.01,42.82 v59.01,43.77 | C6.1
VIN  (via drill 0.35)
  Bottom 0.762: D1.C 7.43,28.68 9.16,26.94 T7.3
  Bottom 1.016: X25.1 5.96,16.12 9.16,19.32 T7.3
  other vias: 4.72,23.45 3.45,23.45 2.18,23.45 4.72,24.72 3.45,24.72 2.18,24.72 4.72,25.99 3.45,25.99 2.18,25.99 2.18,27.26 3.45,27.26 4.72,27.26 5.99,27.26 7.26,27.26 5.99,28.53 7.26,28.53 2.18,28.53 4.72,22.18 3.45,22.18 2.18,22.18 7.58,14.56 2.18,14.56 2.18,18.37
  pour Bottom (no thermals): 1.54,13.93 1.54,29.16 12.02,29.16 12.02,13.93 11.7,13.93
  pour Top (no thermals): 1.54,13.93 1.54,29.16 12.02,29.16 12.02,13.93 11.7,13.93

### Text on the board
tPlace: FT4232@1 Channel A | FT4232@1 Channel B | FT4232@1 Channel C | FT4232@1 Channel D | NC | NC | NC | NC | NC | NC | NC | NC | NC | DTR | NC | DTR | NC | DTR | NC | DTR | 4 JTAG + 4 UART / /8 UART | NC | RXD | NC | RXD | NC | RXD | NC | RXD | RTS | TXD | RTS | TXD | RTS | TXD | RTS | TXD | GND | VCC | GND | VCC | GND | VCC | GND | VCC | VCC | TMS | NC | GND | VCC | TMS | NC | GND | GND | TCK | TDI | NC | GND | TCK | TDI | NC | GND | TDO | TDO | GND | GND | TDO | TDO | GND | FT4232 Frontend A / v1.0 | NC | TDI | TCK | GND | NC | TDI | TCK | GND | GND | NC | TMS | VCC | GND | NC | TMS | VCC | VCC | GND | VCC | GND | VCC | GND | VCC | GND | TXD | RTS | TXD | RTS | TXD | RTS | TXD | RTS | RXD | NC | RXD | NC | RXD | NC | RXD | NC | VCC | DTR | NC | DTR | NC | DTR | NC | DTR | NC | NC | NC | NC | NC | NC | NC | NC | NC | FT4232@2 Channel A | FT4232@2 Channel B | FT4232@2 Channel C | FT4232@2 Channel D | GND
bPlace: J.Kopala / 12.2022